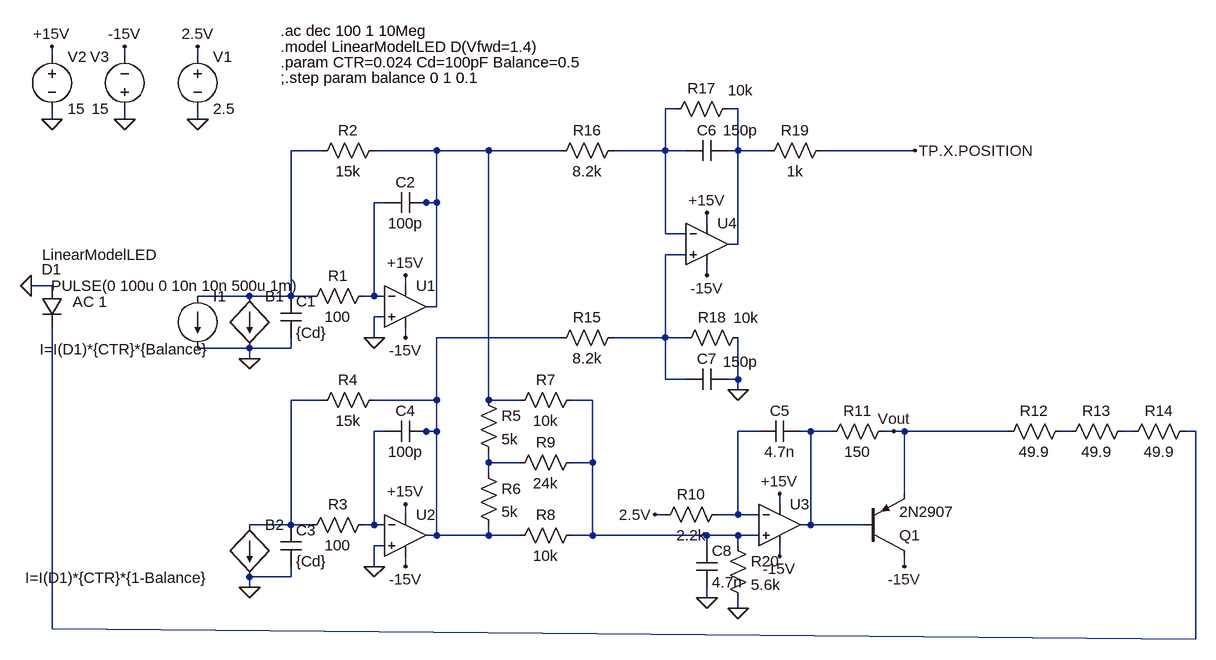
[diagram p0: schematic position-sensor-legacy-polarity-mode.asc]
position-sensor-legacy-polarity-mode.asc, the LTspice schematic file:
Version 4
SHEET 1 1652 1076
WIRE -144 -16 -144 -32
WIRE -32 -16 -32 -32
WIRE 80 -16 80 -32
WIRE 816 64 800 64
WIRE 912 64 896 64
WIRE -144 80 -144 64
WIRE -32 80 -32 64
WIRE 80 80 80 64
WIRE 272 128 224 128
WIRE 448 128 352 128
WIRE 528 128 448 128
WIRE 640 128 528 128
WIRE 800 128 800 64
WIRE 800 128 720 128
WIRE 832 128 800 128
WIRE 912 128 912 64
WIRE 912 128 896 128
WIRE 960 128 912 128
WIRE 1184 128 1040 128
WIRE 368 208 352 208
WIRE 432 208 416 208
WIRE 448 208 448 128
WIRE 448 208 432 208
WIRE 864 240 864 224
WIRE 800 256 800 128
WIRE 832 256 800 256
WIRE 912 272 912 128
WIRE 912 272 896 272
WIRE 832 288 800 288
WIRE 864 320 864 304
WIRE -144 336 -176 336
WIRE 400 336 400 320
WIRE 160 352 80 352
WIRE 224 352 224 128
WIRE 224 352 160 352
WIRE 256 352 224 352
WIRE 352 352 352 208
WIRE 352 352 336 352
WIRE 368 352 352 352
WIRE 448 368 448 208
WIRE 448 368 432 368
WIRE 368 384 352 384
WIRE 352 416 352 384
WIRE 400 416 400 400
WIRE 640 416 448 416
WIRE 800 416 800 288
WIRE 800 416 720 416
WIRE 832 416 800 416
WIRE 160 432 80 432
WIRE 224 432 224 416
WIRE 224 432 160 432
WIRE 160 448 160 432
WIRE 800 480 800 416
WIRE 832 480 800 480
WIRE 912 480 912 416
WIRE 912 480 896 480
WIRE 912 496 912 480
WIRE 272 512 224 512
WIRE 448 512 448 416
WIRE 448 512 352 512
WIRE 528 512 528 128
WIRE 576 512 528 512
WIRE 688 512 656 512
WIRE 368 560 352 560
WIRE 432 560 416 560
WIRE 448 560 448 512
WIRE 448 560 432 560
WIRE 944 560 912 560
WIRE 1024 560 1008 560
WIRE 1056 560 1024 560
WIRE 1152 560 1136 560
WIRE 1168 560 1152 560
WIRE 1328 560 1168 560
WIRE 1424 560 1408 560
WIRE 1520 560 1504 560
WIRE 1616 560 1600 560
WIRE 528 608 528 592
WIRE 576 608 528 608
WIRE 688 608 688 512
WIRE 688 608 656 608
WIRE 528 624 528 608
WIRE 1168 656 1168 560
WIRE 976 672 976 656
WIRE 400 688 400 672
WIRE 800 688 784 688
WIRE 912 688 912 560
WIRE 912 688 880 688
WIRE 944 688 912 688
WIRE 224 704 224 512
WIRE 224 704 160 704
WIRE 256 704 224 704
WIRE 352 704 352 560
WIRE 352 704 336 704
WIRE 368 704 352 704
WIRE 1024 704 1024 560
WIRE 1024 704 1008 704
WIRE 1104 704 1024 704
WIRE 448 720 448 560
WIRE 448 720 432 720
WIRE 528 720 528 704
WIRE 528 720 448 720
WIRE 576 720 528 720
WIRE 688 720 688 608
WIRE 688 720 656 720
WIRE 864 720 688 720
WIRE 912 720 864 720
WIRE 944 720 912 720
WIRE 368 736 352 736
WIRE 864 736 864 720
WIRE 912 736 912 720
WIRE 976 752 976 736
WIRE 352 768 352 736
WIRE 400 768 400 752
WIRE 1168 768 1168 752
WIRE 224 784 224 768
WIRE 224 784 160 784
WIRE 160 800 160 784
WIRE 864 816 864 800
WIRE 912 832 912 816
WIRE -144 864 -144 400
WIRE 1616 880 1616 560
WIRE 1616 880 -144 864
FLAG 160 448 0
FLAG -144 80 0
FLAG -32 80 0
FLAG -144 -32 +15V
FLAG -32 -32 -15V
FLAG 400 320 +15V
FLAG 400 416 -15V
FLAG 352 416 0
FLAG 160 800 0
FLAG 400 672 +15V
FLAG 400 768 -15V
FLAG 352 768 0
FLAG -176 336 0
FLAG 80 80 0
FLAG 80 -32 2.5V
FLAG 784 688 2.5V
FLAG 976 656 +15V
FLAG 976 752 -15V
FLAG 1168 768 -15V
FLAG 864 224 +15V
FLAG 864 320 -15V
FLAG 912 496 0
FLAG 1184 128 TP.X.POSITION
FLAG 864 816 0
FLAG 912 832 0
FLAG 1152 560 Vout
DATAFLAG 448 128 ""
DATAFLAG 448 720 ""
DATAFLAG 1152 128 ""
DATAFLAG 1056 704 ""
DATAFLAG 1264 560 ""
DATAFLAG 1616 688 ""
DATAFLAG 720 720 ""
SYMBOL diode -160 336 R0
WINDOW 3 1 -48 Left 2
WINDOW 0 0 -25 Left 2
SYMATTR Value LinearModelLED
SYMATTR InstName D1
SYMBOL bi 160 352 R0
WINDOW 3 -323 82 Left 2
SYMATTR Value I=I(D1)*{CTR}*{Balance}
SYMATTR InstName B1
SYMBOL cap 208 352 R0
SYMATTR InstName C1
SYMATTR Value {Cd}
SYMBOL OpAmps\\UniversalOpAmp 400 368 R0
SYMATTR InstName U1
SYMBOL res 352 336 R90
WINDOW 0 0 56 VBottom 2
WINDOW 3 32 56 VTop 2
SYMATTR InstName R1
SYMATTR Value 100
SYMBOL voltage -144 -32 R0
SYMATTR InstName V2
SYMATTR Value 15
SYMBOL voltage -32 80 R180
WINDOW 0 24 96 Left 2
WINDOW 3 24 16 Left 2
SYMATTR InstName V3
SYMATTR Value 15
SYMBOL res 368 112 R90
WINDOW 0 0 56 VBottom 2
WINDOW 3 32 56 VTop 2
SYMATTR InstName R2
SYMATTR Value 15k
SYMBOL cap 432 192 R90
WINDOW 0 0 32 VBottom 2
WINDOW 3 32 32 VTop 2
SYMATTR InstName C2
SYMATTR Value 100p
SYMBOL bi 160 704 R0
WINDOW 3 -345 81 Left 2
SYMATTR Value I=I(D1)*{CTR}*{1-Balance}
SYMATTR InstName B2
SYMBOL cap 208 704 R0
SYMATTR InstName C3
SYMATTR Value {Cd}
SYMBOL OpAmps\\UniversalOpAmp 400 720 R0
SYMATTR InstName U2
SYMBOL res 352 688 R90
WINDOW 0 0 56 VBottom 2
WINDOW 3 32 56 VTop 2
SYMATTR InstName R3
SYMATTR Value 100
SYMBOL res 368 496 R90
WINDOW 0 0 56 VBottom 2
WINDOW 3 32 56 VTop 2
SYMATTR InstName R4
SYMATTR Value 15k
SYMBOL cap 432 544 R90
WINDOW 0 0 32 VBottom 2
WINDOW 3 32 32 VTop 2
SYMATTR InstName C4
SYMATTR Value 100p
SYMBOL res 512 496 R0
SYMATTR InstName R5
SYMATTR Value 5k
SYMBOL res 512 608 R0
SYMATTR InstName R6
SYMATTR Value 5k
SYMBOL res 672 496 R90
WINDOW 0 0 56 VBottom 2
WINDOW 3 32 56 VTop 2
SYMATTR InstName R7
SYMATTR Value 10k
SYMBOL res 672 704 R90
WINDOW 0 0 56 VBottom 2
WINDOW 3 32 56 VTop 2
SYMATTR InstName R8
SYMATTR Value 10k
SYMBOL res 672 592 R90
WINDOW 0 0 56 VBottom 2
WINDOW 3 32 56 VTop 2
SYMATTR InstName R9
SYMATTR Value 24k
SYMBOL voltage 80 -32 R0
SYMATTR InstName V1
SYMATTR Value 2.5
SYMBOL res 896 672 R90
WINDOW 0 0 56 VBottom 2
WINDOW 3 32 56 VTop 2
SYMATTR InstName R10
SYMATTR Value 2.2k
SYMBOL OpAmps\\UniversalOpAmp 976 704 R0
SYMATTR InstName U3
SYMBOL cap 1008 544 R90
WINDOW 0 0 32 VBottom 2
WINDOW 3 32 32 VTop 2
SYMATTR InstName C5
SYMATTR Value 4.7n
SYMBOL pnp 1104 752 M180
SYMATTR InstName Q1
SYMATTR Value 2N2907
SYMBOL res 1152 544 R90
WINDOW 0 0 56 VBottom 2
WINDOW 3 32 56 VTop 2
SYMATTR InstName R11
SYMATTR Value 150
SYMBOL res 1424 544 R90
WINDOW 0 0 56 VBottom 2
WINDOW 3 32 56 VTop 2
SYMATTR InstName R12
SYMATTR Value 49.9
SYMBOL res 1520 544 R90
WINDOW 0 0 56 VBottom 2
WINDOW 3 32 56 VTop 2
SYMATTR InstName R13
SYMATTR Value 49.9
SYMBOL res 1616 544 R90
WINDOW 0 0 56 VBottom 2
WINDOW 3 32 56 VTop 2
SYMATTR InstName R14
SYMATTR Value 49.9
SYMBOL OpAmps\\UniversalOpAmp 864 272 R0
SYMATTR InstName U4
SYMBOL cap 896 112 R90
WINDOW 0 0 32 VBottom 2
WINDOW 3 -31 -20 VTop 2
SYMATTR InstName C6
SYMATTR Value 150p
SYMBOL res 736 400 R90
WINDOW 0 0 56 VBottom 2
WINDOW 3 32 56 VTop 2
SYMATTR InstName R15
SYMATTR Value 8.2k
SYMBOL res 736 112 R90
WINDOW 0 0 56 VBottom 2
WINDOW 3 32 56 VTop 2
SYMATTR InstName R16
SYMATTR Value 8.2k
SYMBOL res 912 48 R90
WINDOW 0 0 56 VBottom 2
WINDOW 3 -28 -4 VTop 2
SYMATTR InstName R17
SYMATTR Value 10k
SYMBOL res 928 400 R90
WINDOW 0 0 56 VBottom 2
WINDOW 3 -30 4 VTop 2
SYMATTR InstName R18
SYMATTR Value 10k
SYMBOL cap 896 464 R90
WINDOW 0 0 32 VBottom 2
WINDOW 3 -27 -20 VTop 2
SYMATTR InstName C7
SYMATTR Value 150p
SYMBOL res 1056 112 R90
WINDOW 0 0 56 VBottom 2
WINDOW 3 32 56 VTop 2
SYMATTR InstName R19
SYMATTR Value 1k
SYMBOL res 896 720 R0
SYMATTR InstName R20
SYMATTR Value 5.6k
SYMBOL cap 848 736 R0
SYMATTR InstName C8
SYMATTR Value 4.7n
SYMBOL current 80 352 R0
WINDOW 3 -225 -16 Left 2
WINDOW 123 -192 9 Left 2
WINDOW 39 0 0 Left 0
SYMATTR InstName I1
SYMATTR Value PULSE(0 100u 0 10n 10n 500u 1m)
SYMATTR Value2 AC 1
TEXT 208 -32 Left 2 !.model LinearModelLED D(Vfwd=1.4)
TEXT 208 -8 Left 2 !.param CTR=0.024 Cd=100pF Balance=0.5
TEXT 208 16 Left 2 !;.step param balance 0 1 0.1
TEXT 208 -56 Left 2 !.ac dec 100 1 10Meg

The netlist it stands for:
* position-sensor-legacy-polarity-mode.asc
D1 0 N015 LinearModelLED
B1 N003 0 I=I(D1)*{CTR}*{Balance}
C1 N003 0 {Cd}
XU1 0 N005 +15V -15V N004 level1 Avol=1Meg GBW=10Meg Vos=0 En=0 Enk=0 In=0 Ink=0 Rin=500Meg  ; pins In+ In- V+ V- OUT
R1 N005 N003 100
V2 +15V 0 15
V3 0 -15V 15
R2 N004 N003 15k
C2 N004 N005 100p
B2 N008 0 I=I(D1)*{CTR}*{1-Balance}
C3 N008 0 {Cd}
XU2 0 N010 +15V -15V N007 level1 Avol=1Meg GBW=10Meg Vos=0 En=0 Enk=0 In=0 Ink=0 Rin=500Meg  ; pins In+ In- V+ V- OUT
R3 N010 N008 100
R4 N007 N008 15k
C4 N007 N010 100p
R5 N004 N016 5k
R6 N016 N007 5k
R7 N009 N004 10k
R8 N009 N007 10k
R9 N009 N016 24k
V1 2.5V 0 2.5
R10 N011 2.5V 2.2k
XU3 N009 N011 +15V -15V N012 level1 Avol=1Meg GBW=10Meg Vos=0 En=0 Enk=0 In=0 Ink=0 Rin=500Meg  ; pins In+ In- V+ V- OUT
C5 N012 N011 4.7n
Q1 -15V N012 Vout 0 2N2907
R11 Vout N012 150
R12 N013 Vout 49.9
R13 N014 N013 49.9
R14 N015 N014 49.9
XU4 N006 N001 +15V -15V N002 level1 Avol=1Meg GBW=10Meg Vos=0 En=0 Enk=0 In=0 Ink=0 Rin=500Meg  ; pins In+ In- V+ V- OUT
C6 N002 N001 150p
R15 N006 N007 8.2k
R16 N001 N004 8.2k
R17 N002 N001 10k
R18 0 N006 10k
C7 0 N006 150p
R19 TP.X.POSITION N002 1k
R20 N009 0 5.6k
C8 N009 0 4.7n
I1 N003 0 PULSE(0 100u 0 10n 10n 500u 1m) AC 1
.model D D
.lib standard.dio
.model NPN NPN
.model PNP PNP
.lib standard.bjt
.model LinearModelLED D(Vfwd=1.4)
.param CTR=0.024 Cd=100pF Balance=0.5
;.step param balance 0 1 0.1
.ac dec 100 1 10Meg
.lib UniversalOpAmp1.lib
.backanno
.end